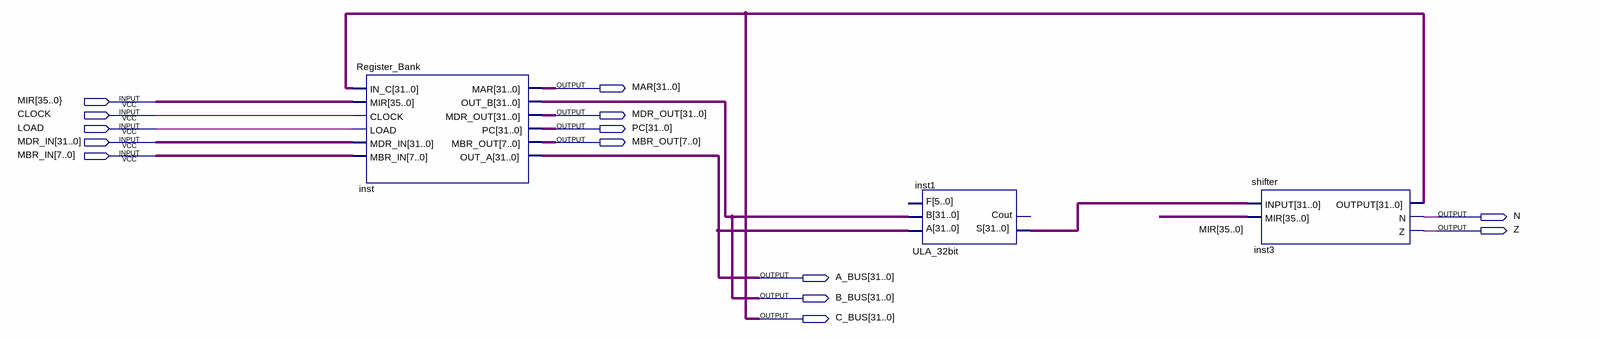
[diagram p0: schematic sheet]
// Quartus schematic DATAPATH.bdf as structural Verilog: 3 symbols, 14 pins
module DATAPATH (
  input  \MIR[35..0} ,
  input  CLOCK,
  input  LOAD,
  input  [31:0] MDR_IN,
  input  [7:0] MBR_IN,
  output [31:0] MAR,
  output [31:0] MDR_OUT,
  output [31:0] PC,
  output [7:0] MBR_OUT,
  output N,
  output Z,
  output [31:0] A_BUS,
  output [31:0] B_BUS,
  output [31:0] C_BUS
);

  wire [31:0] inst1_s;
  wire [35:0] MIR, undriven;

  Register_Bank inst (
    .IN_C(C_BUS), .MIR(undriven), .CLOCK(CLOCK), .LOAD(LOAD), .MDR_IN(MDR_IN), .MBR_IN(MBR_IN), .MAR(MAR),
    .OUT_B(B_BUS), .MDR_OUT(MDR_OUT), .PC(PC), .MBR_OUT(MBR_OUT), .OUT_A(A_BUS));
  ULA_32bit inst1 (.A(A_BUS), .B(B_BUS), .S(inst1_s));  // open: F, Cout
  shifter inst3 (.INPUT(inst1_s), .MIR(MIR), .OUTPUT(C_BUS), .N(N), .Z(Z));
endmodule
